# EAGLE design CPU_v3_1 (EAGLE 9.6.2)
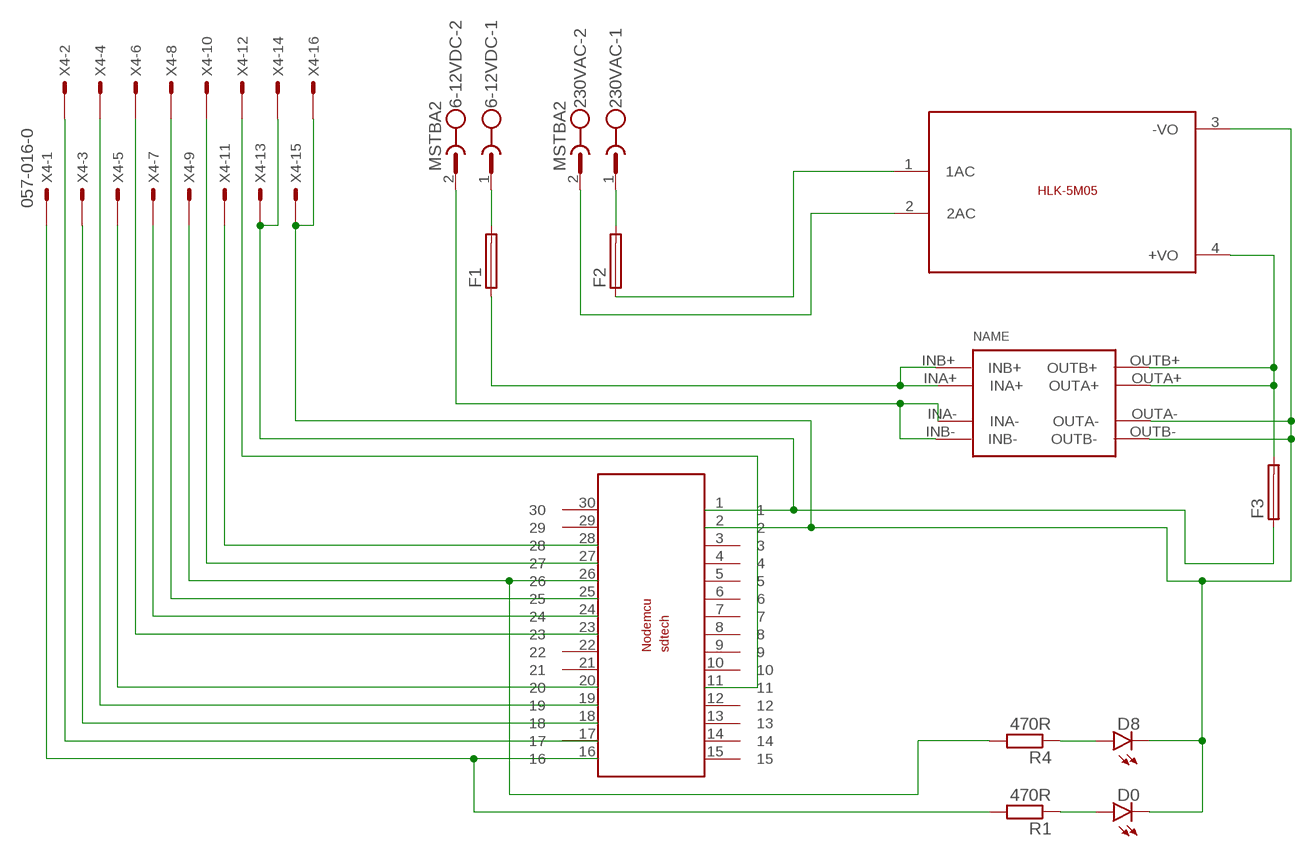
[diagram p0: schematic, sheet 1]

## Parts
6-12VDC  MSTBA2  [MSTBA2]
230VAC  MSTBA2  [MSTBA2]
D0  LED3MM  [LED3MM]
D8  LED3MM  [LED3MM]
F1  SH22,5A  [SH22,5A]
F2  SH22,5A  [SH22,5A]
F3  SH22,5A  [SH22,5A]
R1  470R  R-EU_0309/10  [0309/10]
R4  470R  R-EU_0309/10  [0309/10]
U$1  NODEMCUESP8266  [NODEMCUESP8266]
U$2  CP8-ADJ-B  [CP8-ADJ-B]
U$3  5VDC/5W  HLK-5M05  [HLK-5M05]
X4  057-016-0  [057-016-0]

## Nets
+5VDC: F3.1 U$1.1 X4.13 X4.14
D0: R1.2 U$1.16 X4.1
D8: R4.2 U$1.26 X4.9
D9: U$1.11 X4.12
GND: D0.K(C) D8.K(C) U$1.2 U$2.OUTA- U$2.OUTB- U$3.3(-VO) X4.15 X4.16
N$1: D8.A R4.1
N$3: U$1.19 X4.4
N$4: D0.A R1.1
N$5: 230VAC.1 F2.2
N$6: F2.1 U$3.1(1AC)
N$7: 230VAC.2 U$3.2(2AC)
N$8: 6-12VDC.1 F1.2
N$9: F1.1 U$2.INA+ U$2.INB+
N$10: 6-12VDC.2 U$2.INA- U$2.INB-
N$11: U$1.20 X4.5
N$12: U$1.23 X4.6
N$13: U$1.24 X4.7
N$14: U$1.25 X4.8
N$15: F3.2 U$2.OUTA+ U$2.OUTB+ U$3.4(+VO)
RX: U$1.27 X4.10
SCL: U$1.17 X4.2
SDA: U$1.18 X4.3
TX: U$1.28 X4.11
Unconnected: U$1.3 U$1.4 U$1.5 U$1.6 U$1.7 U$1.8 U$1.9 U$1.10 U$1.12 U$1.13 U$1.14 U$1.15 U$1.21 U$1.22 U$1.29 U$1.30

## Library data of the parts
6-12VDC 230VAC = con-phoenix-508:MSTBA2: PHOENIX; MF: FARNELL; MPN: 1757242; OC_FARNELL: 3705171; OC_NEWARK: 71C4161
D0 D8 = led:LED: LED OSRAM: - CHIPLED LG R971, LG N971, LY N971, LG Q971, LY Q971, LO R971, LY R971 LH N974, LH R974 LS Q976, LO Q976, LY Q976 LO Q996 - Hyper CHIPLED LW Q18S LB Q993, LB Q99A, LB R99A - SideLED LS A670, LO A670, LY A670, LG A670, LP A670 LB A673, LV A673, LT A673, LW A673 LH A674 LY A675 LS A676, LA A676, LO A676, LY A676, LW A676 LS A679, LY A679, LG A679 - Hyper Micro SIDELED® LS Y876, LA Y876, LO Y876, LY Y876 LT Y87S - SmartLED LW L88C, LW L88S LB L89C, LB L89S, LG L890 LS L89K, LO L89K, LY L89K LS L896, LA L896, LO L896, LY L896 - TOPLED LS T670, LO T670, LY T670, LG T670, LP T670 LSG T670, LSP T670, LSY T670, LOP T670, LYG T670 LG T671, LOG T671, LSG T671 LB T673, LV T673, LT T673, LW T673 LH T674 LS T676, LA T676, LO T676, LY T676, LB T676, LH T676, LSB T676, LW T676 LB T67C, LV T67C, LT T67C, LS T67K, LO T67K, LY T67K, LW E67C LS E67B, LA E67B, LO E67B, LY E67B, LB E67C, LV E67C, LT E67C LW T67C LS T679, LY T679, LG T679 LS T770, LO T770, LY T770, LG T770, LP T770 LB T773, LV T773, LT T773, LW T773 LH T774 LS E675, LA E675, LY E675, LS T675 LS T776, LA T776, LO T776, LY T776, LB T776 LHGB T686 LT T68C, LB T68C - Hyper Mini TOPLED® LB M676 - Mini TOPLED Santana® LG M470 LS M47K, LO M47K, LY M47K Source: http://www.osram.convergy.de LUXEON: - LUMILED® LXK2-PW12-R00, LXK2-PW12-S00, LXK2-PW14-U00, LXK2-PW14-V00 LXK2-PM12-R00, LXK2-PM12-S00, LXK2-PM14-U00 LXK2-PE12-Q00, LXK2-PE12-R00, LXK2-PE12-S00, LXK2-PE14-T00, LXK2-PE14-U00 LXK2-PB12-K00, LXK2-PB12-L00, LXK2-PB12-M00, LXK2-PB14-N00, LXK2-PB14-P00, LXK2-PB14-Q00 LXK2-PR12-L00, LXK2-PR12-M00, LXK2-PR14-Q00, LXK2-PR14-R00 LXK2-PD12-Q00, LXK2-PD12-R00, LXK2-PD12-S00 LXK2-PH12-R00, LXK2-PH12-S00 LXK2-PL12-P00, LXK2-PL12-Q00, LXK2-PL12-R00 Source: www.luxeon.com KINGBRIGHT: KA-3528ASYC Source: www.kingbright.com
F1-F3 = fuse:SH22,5A: FUSE HOLDER grid 22,5mm, isolated cap OGN0031 8201, Schurter (Buerklin); MPN: 0031.7701.11; OC_FARNELL: unknown; OC_NEWARK: 04F1224
R1 R4 = resistor:R-EU_: RESISTOR, European symbol
U$1 = NODEMCU2:NODEMCUESP8266: Node Mcu esp8266 12E LIBRARY BY SDTECH ROBOTICS (Shubham Devkar Technology Solutions); SPICEPREFIX: X
U$2 = userlib:CP8-ADJ-B: Voltage regulator IN: 7-35V OUT: ADJ
U$3 = HLK-5M05:HLK-5M05: HLK-5M05 is an 5Volt/5W smps developed by HI-LINK; SIZE: 23x38(mm)
X4 = con-panduit:057-016-: CONNECTOR 10-pin series 057 contact pc board low profile headers; OC_FARNELL: unknown; OC_NEWARK: unknown

## Board
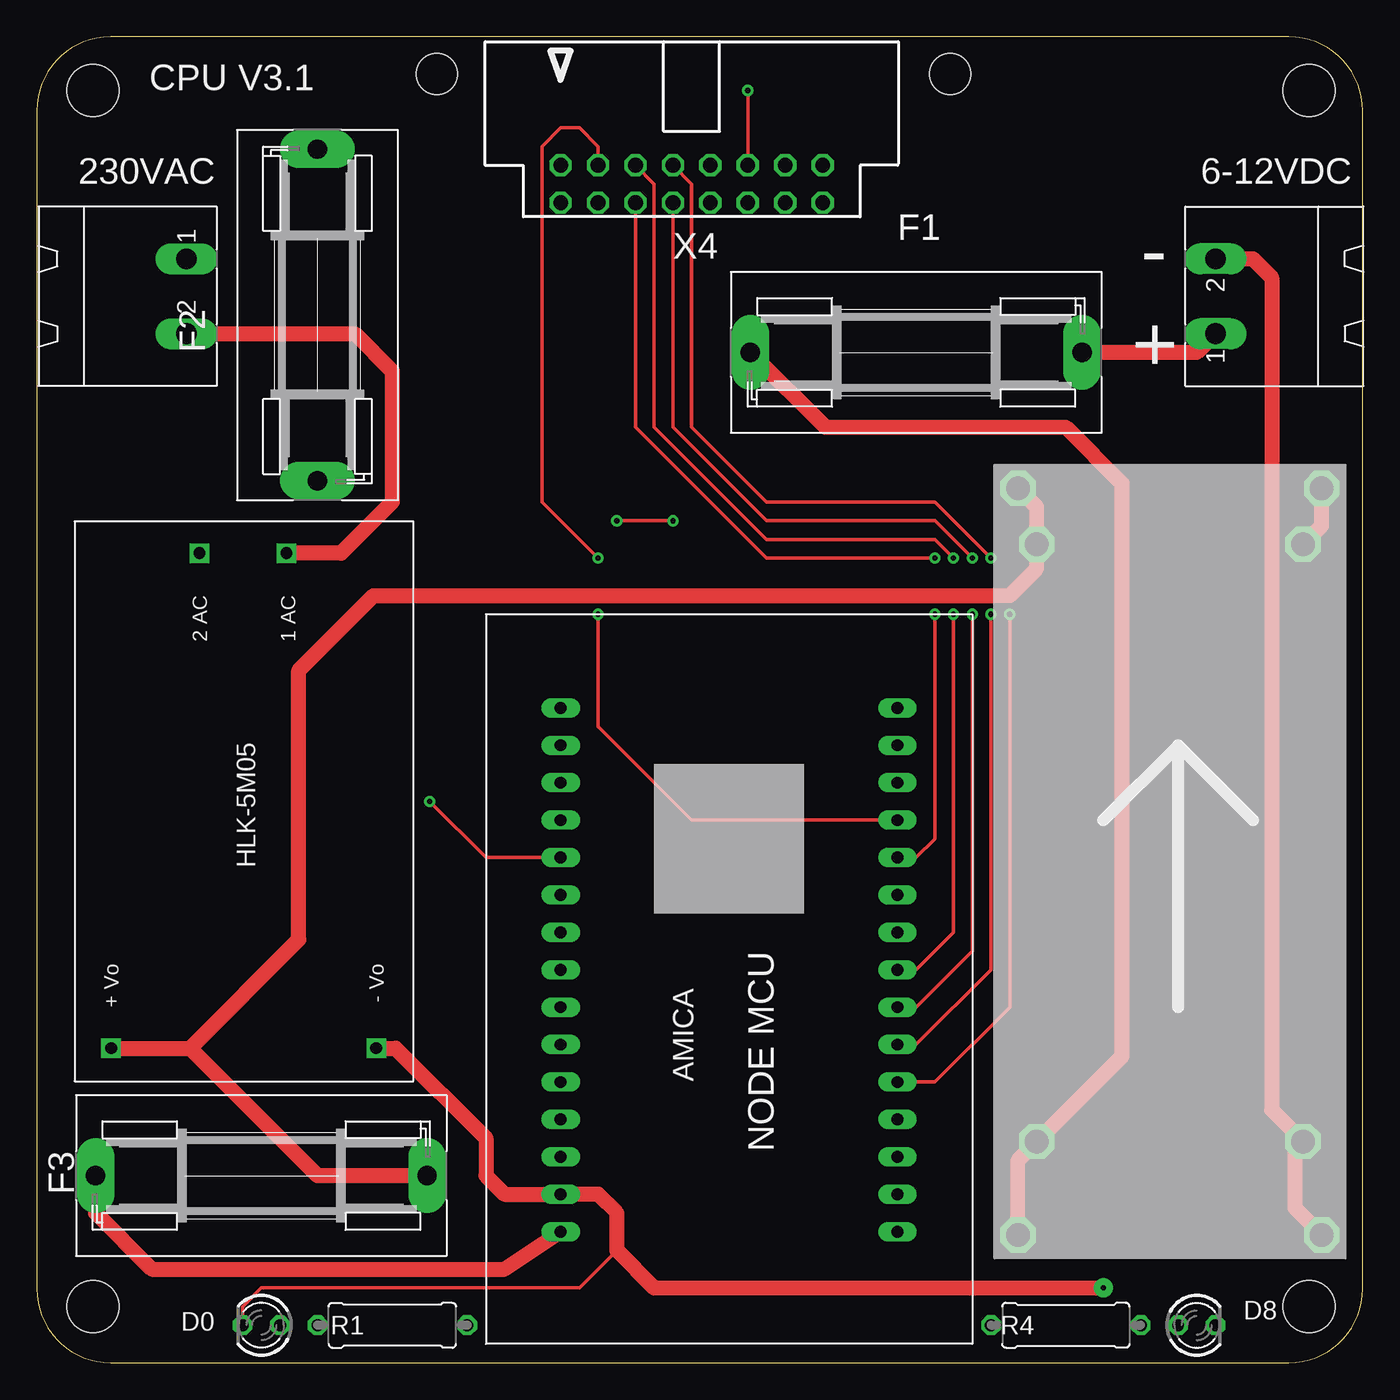
[diagram p1: board, top side]
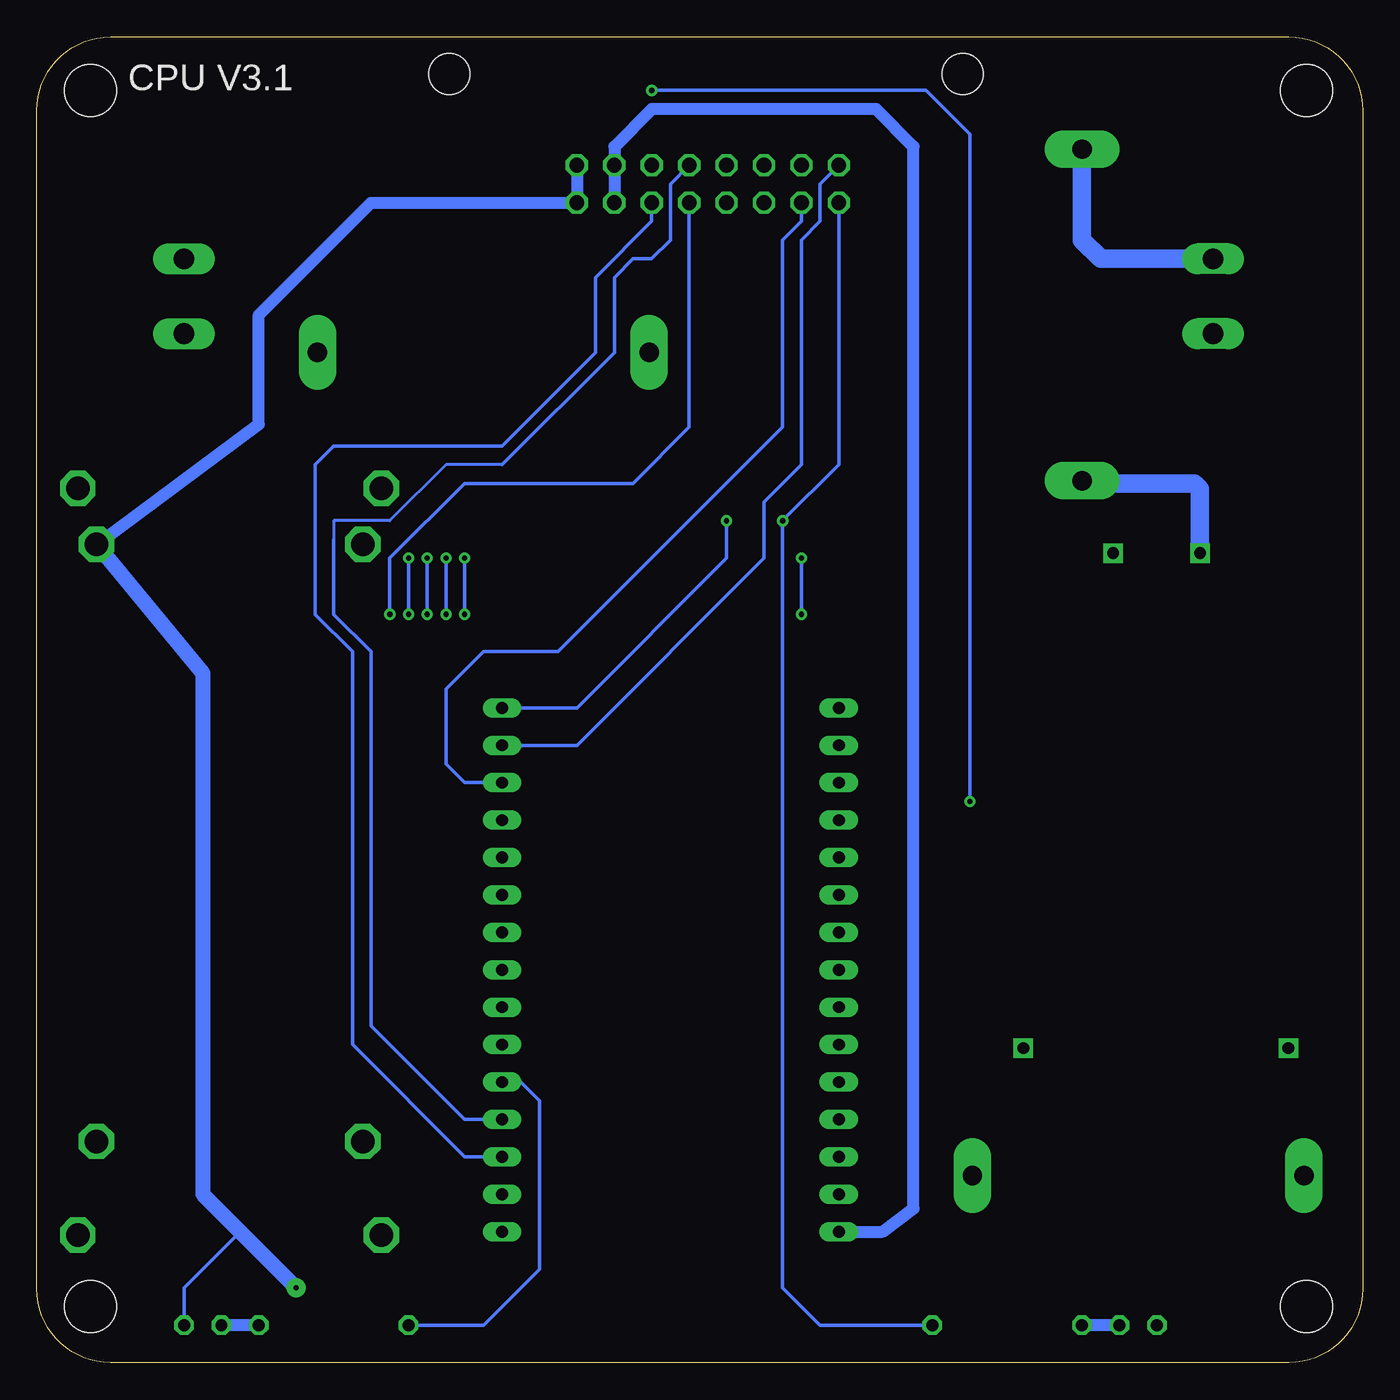
[diagram p2: board, bottom side, seen from below]

Size 90 x 90 mm. Coordinates in mm from the lower left corner, seen from the top.
Outline: 0,85 0,5 arc90 5,0 85,0 arc90 90,5 90,85 arc90 85,90 5,90 arc90 0,85
Copper layers (1*16): Top 0.035mm / dielectric 1.5mm / Bottom 0.035mm
Design rules "default": minimum track width 6mil, minimum drill 0.35mm, track to track 6mil, track to pad 6mil, pad to pad 6mil, via to via 6mil, smd to smd 6mil, copper to edge 40mil, drill to drill 6mil, minimum pad ring 10mil, minimum via ring 8mil, stop-mask expansion 4mil, vias tented up to drill 0mil, thermal gap 10mil
Holes 3.5 mm at 86.36,86.36 3.81,86.36 3.81,3.81 86.36,3.81

### Footprints (pad centres in the part's own frame; a part is rotated, then mirrored left to right if it is on the bottom)
MSTBA2 = drill 1.397 long: 1 -2.54,5.08; 2 2.54,5.08
LED3MM = drill 0.813 octagon: A -1.27,0; K 1.27,0
SH22,5A = drill 1.321 pad 2.54 long: 1 -11.252,0; 2 11.252,0
0309/10 = drill 0.813 octagon: 1 -5.08,0; 2 5.08,0
NODEMCUESP8266 = drill 0.8 long: 1 13.97,15.24; 2 13.97,12.7; 3 13.97,10.16; 4 13.97,7.62; 5 13.97,5.08; 6 13.97,2.54; 7 13.97,0; 8 13.97,-2.54; 9 13.97,-5.08; 10 13.97,-7.62; 11 13.97,-10.16; 12 13.97,-12.7; 13 13.97,-15.24; 14 13.97,-17.78; 15 13.97,-20.32; 16 -8.89,-20.32; 17 -8.89,-17.78; 18 -8.89,-15.24; 19 -8.89,-12.7; 20 -8.89,-10.16; 21 -8.89,-7.62; 22 -8.89,-5.08; 23 -8.89,-2.54; 24 -8.89,0; 25 -8.89,2.54; 26 -8.89,5.08; 27 -8.89,7.62; 28 -8.89,10.16; 29 -8.89,12.7; 30 -8.89,15.24
CP8-ADJ-B = drill 1.6 octagon: INA+ -19.27,8.32; INA- -19.27,-9.75; INB+ -25.62,9.59; INB- -25.62,-11.02; OUTA+ 21.26,8.32; OUTA- 21.26,-9.75; OUTB+ 25.07,9.59; OUTB- 25.07,-11.02
HLK-5M05 = drill 0.8 square: 1 -16.85,-2.93; 2 -16.85,2.97; 3 16.75,9.07; 4 16.75,-8.93
057-016-0 = drill 1 octagon: 1 -8.89,-5.08; 2 -8.89,-2.54; 3 -6.35,-5.08; 4 -6.35,-2.54; 5 -3.81,-5.08; 6 -3.81,-2.54; 7 -1.27,-5.08; 8 -1.27,-2.54; 9 1.27,-5.08; 10 1.27,-2.54; 11 3.81,-5.08; 12 3.81,-2.54; 13 6.35,-5.08; 14 6.35,-2.54; 15 8.89,-5.08; 16 8.89,-2.54 | hole 2.8: -17.29,3.66; 17.54,3.66

### Placement (x,y rotation side)
6-12VDC  85.09,72.39 90 top
230VAC  5.08,72.39 270 top
D0  15.24,2.54 180 top
D8  78.74,2.54 0 top
F1  59.69,68.58 0 top
F2  19.05,71.12 90 top
F3  15.24,12.7 0 top
R1  24.13,2.54 0 top
R4  69.85,2.54 180 top
U$1  49.53,24.13 180 top
U$2  76.2,34.29 90 top
U$3  13.97,38.1 270 top
X4  44.45,83.82 0 top

### Tracks (layer width: path | path; a pad name or v marks a point on that pad's centre or on a via)
+5VDC
  Top 1.016: F3.1 3.99,10.16 7.8,6.35 31.75,6.35 U$1.1
  Bottom 0.813: X4.13 X4.14 50.8,82.55 48.26,85.09 33.02,85.09 30.48,82.55 30.48,10.48 32.6,8.89 U$1.1
D0  (via drill 0.35)
  Top 0.254: v39.37,57.15 v43.18,57.15
  Bottom 0.254: U$1.16 53.34,44.45 43.18,54.61 v43.18,57.15 | R1.2 36.83,2.54 39.37,5.08 v39.37,57.15 35.56,60.96 X4.1
D8  (via drill 0.35)
  Top 0.254: U$1.26 60.96,19.05 66.04,24.13 v66.04,50.8
  Bottom 0.254: R4.2 59.69,2.54 55.88,6.35 55.88,17.78 57.15,19.05 U$1.26 | v66.04,50.8 66.04,54.61 60.96,59.69 49.53,59.69 45.72,63.5 X4.9
D9  (via drill 0.35)
  Top 0.254: U$1.11 30.48,34.29 v26.67,38.1 | v48.26,86.36 X4.12
  Bottom 0.254: v26.67,38.1 26.67,83.39 29.64,86.36 v48.26,86.36
GND  (via drill 0.35 pad 1.3)
  Top 0.254: D0.K 13.97,3.81 15.24,5.08 36.83,5.08 39.37,7.62
  Top 1.016: U$3.3 24.37,21.35 30.48,15.24 30.48,12.7 31.75,11.43 U$1.2 38.1,11.43 39.37,10.16 39.37,7.62 41.91,5.08 v72.39,5.08 | U$2.OUTA- 87.22,56.82 U$2.OUTB-
  Bottom 0.254: D8.K 80.01,5.08 76.2,8.89
  Bottom 0.813: X4.16 X4.15 67.31,78.74 74.93,71.12 74.93,63.7 U$2.OUTA-
  Bottom 1.016: U$2.OUTA- 78.74,46.8 78.74,11.43 76.2,8.89 73.66,6.35 v72.39,5.08
N$1
  Bottom 0.813: R4.1 D8.A
N$3  (via drill 0.35)
  Top 0.254: U$1.19 44.45,36.83 38.1,43.18 v38.1,50.8 | v38.1,54.61 34.29,58.42 34.29,82.55 35.56,83.82 36.83,83.82 38.1,82.55 X4.4
  Bottom 0.254: v38.1,50.8 v38.1,54.61
N$4
  Bottom 0.813: D0.A R1.1
N$5
  Bottom 1.27: 230VAC.1 17.78,74.93 19.05,76.2 F2.2
N$6
  Bottom 1.27: F2.1 18.87,59.69 11.43,59.69 11.04,59.3 U$3.1
N$7
  Top 1.016: 230VAC.2 21.59,69.85 24.13,67.31 24.13,58.42 20.66,54.95 U$3.2
N$8
  Top 1.016: 6-12VDC.1 78.74,68.58 F1.2
N$9
  Top 1.016: F1.1 53.52,63.5 69.85,63.5 73.66,59.69 73.66,20.8 U$2.INA+ 66.61,13.75 U$2.INB+
N$10
  Top 1.016: 6-12VDC.2 82.55,74.93 83.82,73.66 83.82,17.15 85.41,15.56 | U$2.INA- 85.41,15.56 | U$2.INB- 85.41,10.48 85.41,15.56
N$11  (via drill 0.35)
  Top 0.254: U$1.20 59.69,34.29 60.96,35.56 v60.96,50.8 | v60.96,54.61 49.53,54.61 40.64,63.5 X4.5
  Bottom 0.254: v60.96,50.8 v60.96,54.61
N$12  (via drill 0.35)
  Top 0.254: U$1.23 59.69,26.67 62.23,29.21 v62.23,50.8 | v62.23,54.61 60.96,55.88 49.53,55.88 41.91,63.5 41.91,80.01 X4.6
  Bottom 0.254: v62.23,50.8 v62.23,54.61
N$13  (via drill 0.35)
  Top 0.254: U$1.24 59.69,24.13 63.5,27.94 v63.5,50.8 | v63.5,54.61 60.96,57.15 49.53,57.15 43.18,63.5 X4.7
  Bottom 0.254: v63.5,50.8 v63.5,54.61
N$14  (via drill 0.35)
  Top 0.254: U$1.25 59.69,21.59 64.77,26.67 v64.77,50.8 | v64.77,54.61 60.96,58.42 49.53,58.42 44.45,63.5 44.45,80.01 X4.8
  Bottom 0.254: v64.77,50.8 v64.77,54.61
N$15
  Top 1.016: U$3.4 10.4,21.35 | 10.4,21.35 19.05,12.7 F3.2 | 10.4,21.35 17.78,28.73 17.78,46.99 22.86,52.07 66.04,52.07 67.88,53.91 U$2.OUTA+ 67.88,58.09 U$2.OUTB+
RX
  Bottom 0.2: 58.42,60.96 62.23,60.96 66.04,57.15 69.85,57.15 69.85,55.88
  Bottom 0.254: U$1.27 60.96,16.51 67.31,22.86 67.31,48.26 69.85,50.8 69.85,55.88 | 58.42,60.96 50.8,68.58 50.8,73.66 49.53,74.93 48.26,74.93 46.99,76.2 46.99,80.01 X4.10
SCL
  Bottom 0.254: U$1.17 53.34,41.91 40.64,54.61 40.64,58.42 38.1,60.96 38.1,76.2 36.83,77.47 36.83,80.01 X4.2
SDA
  Bottom 0.254: U$1.18 60.96,39.37 62.23,40.64 62.23,45.72 59.69,48.26 54.61,48.26 39.37,63.5 39.37,76.2 38.1,77.47 X4.3
TX
  Bottom 0.254: X4.11 48.26,77.47 52.07,73.66 52.07,68.58 58.42,62.23 69.85,62.23 71.12,60.96 71.12,50.8 68.58,48.26 68.58,21.59 60.96,13.97 U$1.28

### Text on the board
tNames: CPU V3.1 | - | +
bNames: CPU V3.1